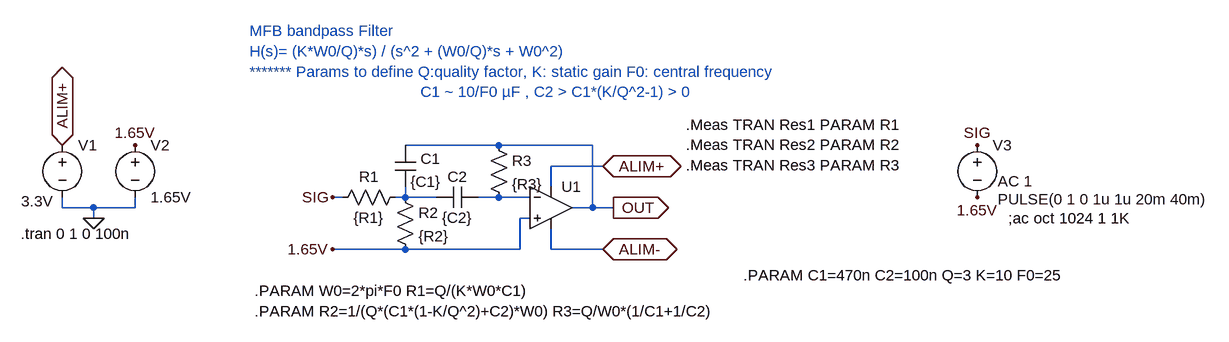
[diagram p0: schematic MFB-BandPass.asc]
MFB-BandPass.asc, the LTspice schematic file:
Version 4
SHEET 1 880 680
WIRE -400 16 -544 16
WIRE -256 16 -400 16
WIRE -240 48 -320 48
WIRE -320 80 -320 48
WIRE -640 96 -656 96
WIRE -544 96 -544 80
WIRE -544 96 -560 96
WIRE -496 96 -544 96
WIRE -400 96 -432 96
WIRE -352 96 -400 96
WIRE -1072 112 -1072 96
WIRE -1024 112 -1072 112
WIRE -960 112 -960 96
WIRE -960 112 -1024 112
WIRE -256 112 -256 16
WIRE -256 112 -288 112
WIRE -224 112 -256 112
WIRE -1024 128 -1024 112
WIRE -352 128 -368 128
WIRE -544 176 -656 176
WIRE -368 176 -368 128
WIRE -368 176 -544 176
WIRE -320 176 -320 144
WIRE -240 176 -320 176
FLAG -240 48 ALIM+
IOPIN -240 48 BiDir
FLAG -240 176 ALIM-
IOPIN -240 176 BiDir
FLAG -224 112 OUT
IOPIN -224 112 Out
FLAG -1024 128 0
FLAG -1072 16 ALIM+
IOPIN -1072 16 BiDir
FLAG -960 16 1.65V
FLAG 336 96 1.65V
FLAG -656 176 1.65V
FLAG 336 16 SIG
FLAG -656 96 SIG
SYMBOL Opamps\\UniversalOpamp2 -320 112 R0
SYMATTR InstName U1
SYMBOL res -544 80 R90
WINDOW 0 0 56 VBottom 2
WINDOW 3 32 56 VTop 2
SYMATTR InstName R1
SYMATTR Value {R1}
SYMBOL res -560 80 R0
SYMATTR InstName R2
SYMATTR Value {R2}
SYMBOL res -416 0 R0
SYMATTR InstName R3
SYMATTR Value {R3}
SYMBOL cap -560 16 R0
WINDOW 0 39 21 Left 2
SYMATTR InstName C1
SYMATTR Value {C1}
SYMBOL cap -496 80 M90
WINDOW 0 0 32 VBottom 2
WINDOW 3 32 32 VTop 2
SYMATTR InstName C2
SYMATTR Value {C2}
SYMBOL voltage -1072 0 R0
WINDOW 3 -63 102 Left 2
WINDOW 123 0 0 Left 2
WINDOW 39 0 0 Left 2
SYMATTR Value 3.3V
SYMATTR InstName V1
SYMBOL voltage -960 0 R0
WINDOW 123 0 0 Left 2
WINDOW 39 0 0 Left 2
SYMATTR InstName V2
SYMATTR Value 1.65V
SYMBOL voltage 336 0 R0
WINDOW 3 32 99 Left 2
WINDOW 123 32 71 Left 2
WINDOW 39 0 0 Left 2
SYMATTR InstName V3
SYMATTR Value PULSE(0 1 0 1u 1u 20m 40m)
SYMATTR Value2 AC 1
TEXT -784 -160 Left 2 ;MFB bandpass Filter\nH(s)= (K*W0/Q)*s) / (s^2 + (W0/Q)*s + W0^2)\n******* Params to define Q:quality factor, K: static gain F0: central frequency\n                                      C1 ~ 10/F0 µF , C2 > C1*(K/Q^2-1) > 0
TEXT -776 240 Left 2 !.PARAM W0=2*pi*F0 R1=Q/(K*W0*C1) \n.PARAM R2=1/(Q*(C1*(1-K/Q^2)+C2)*W0) R3=Q/W0*(1/C1+1/C2)
TEXT -112 -16 Left 2 !.Meas TRAN Res1 PARAM R1\n.Meas TRAN Res2 PARAM R2\n.Meas TRAN Res3 PARAM R3
TEXT -1136 152 Left 2 !.tran 0 1 0 100n
TEXT -24 216 Left 2 !.PARAM C1=470n C2=100n Q=3 K=10 F0=25
TEXT 384 128 Left 2 !;ac oct 1024 1 1K

The netlist it stands for:
* MFB-BandPass.asc
XU1 1.65V N002 ALIM+ ALIM- OUT level.2 Avol=1Meg GBW=10Meg Slew=10Meg ilimit=25m rail=0 Vos=0 phimargin=45 en=0 enk=0 in=0 ink=0 Rin=500Meg  ; pins IN+ IN- V+ V- OUT
R1 N001 SIG {R1}
R2 N001 1.65V {R2}
R3 OUT N002 {R3}
C1 OUT N001 {C1}
C2 N001 N002 {C2}
V1 ALIM+ 0 3.3V
V2 1.65V 0 1.65V
V3 SIG 1.65V PULSE(0 1 0 1u 1u 20m 40m) AC 1
* MFB bandpass Filter
* H(s)= (K*W0/Q)*s) / (s^2 + (W0/Q)*s + W0^2)
* ******* Params to define Q:quality factor, K: static gain F0: central frequency
*                                       C1 ~ 10/F0 µF , C2 > C1*(K/Q^2-1) > 0
.PARAM W0=2*pi*F0 R1=Q/(K*W0*C1)
.PARAM R2=1/(Q*(C1*(1-K/Q^2)+C2)*W0) R3=Q/W0*(1/C1+1/C2)
.Meas TRAN Res1 PARAM R1
.Meas TRAN Res2 PARAM R2
.Meas TRAN Res3 PARAM R3
.tran 0 1 0 100n
.PARAM C1=470n C2=100n Q=3 K=10 F0=25
;ac oct 1024 1 1K
.lib UniversalOpamps2.sub
.backanno
.end